# Altium schematic sheet Top Level.SchDoc
size A
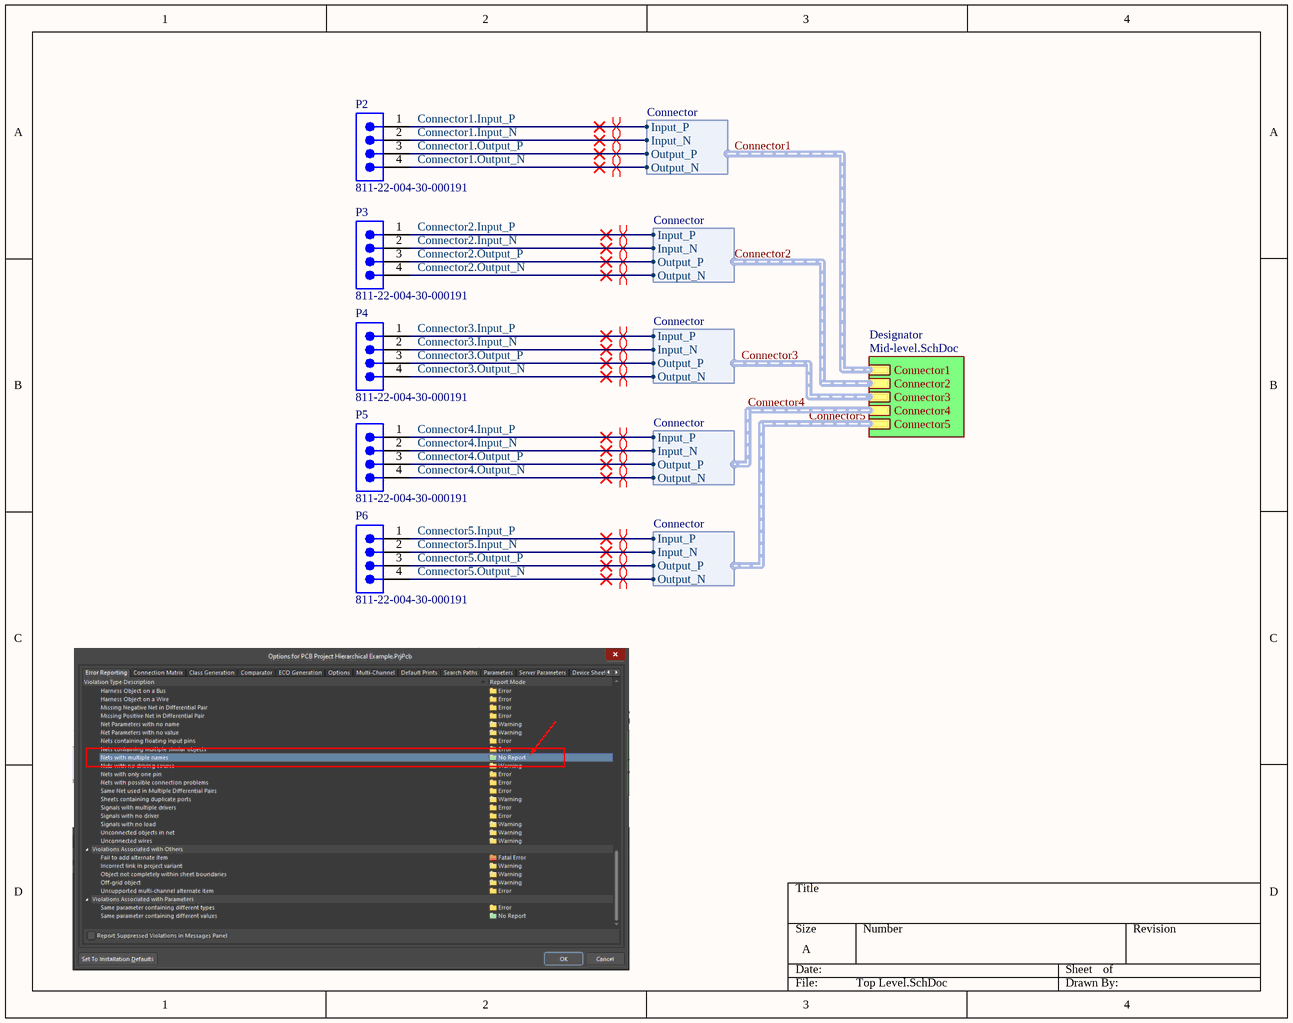
[diagram p0: Top Level.SchDoc]

## Parts
P2  811-22-004-30-000191  [MILL-MAX_811-22-004-30-0001910]
P3  811-22-004-30-000191  [MILL-MAX_811-22-004-30-0001910]
P4  811-22-004-30-000191  [MILL-MAX_811-22-004-30-0001910]
P5  811-22-004-30-000191  [MILL-MAX_811-22-004-30-0001910]
P6  811-22-004-30-000191  [MILL-MAX_811-22-004-30-0001910]

## Sub-sheets
Designator = Mid-level.SchDoc: Connector4 (harness Connector), Connector5 (harness Connector), Connector3 (harness Connector), Connector2 (harness Connector), Connector1 (harness Connector)

## Harnesses
Connector: Input_P, Input_N, Output_P, Output_N

## Nets
Connector1.Input_N: P2.2 ; sheet Designator/Connector1.Input_N
Connector1.Input_P: P2.1 ; sheet Designator/Connector1.Input_P
Connector1.Output_N: P2.4 ; sheet Designator/Connector1.Output_N
Connector1.Output_P: P2.3 ; sheet Designator/Connector1.Output_P
Connector2.Input_N: P3.2 ; sheet Designator/Connector2.Input_N
Connector2.Input_P: P3.1 ; sheet Designator/Connector2.Input_P
Connector2.Output_N: P3.4 ; sheet Designator/Connector2.Output_N
Connector2.Output_P: P3.3 ; sheet Designator/Connector2.Output_P
Connector3.Input_N: P4.2 ; sheet Designator/Connector3.Input_N
Connector3.Input_P: P4.1 ; sheet Designator/Connector3.Input_P
Connector3.Output_N: P4.4 ; sheet Designator/Connector3.Output_N
Connector3.Output_P: P4.3 ; sheet Designator/Connector3.Output_P
Connector4.Input_N: P5.2 ; sheet Designator/Connector4.Input_N
Connector4.Input_P: P5.1 ; sheet Designator/Connector4.Input_P
Connector4.Output_N: P5.4 ; sheet Designator/Connector4.Output_N
Connector4.Output_P: P5.3 ; sheet Designator/Connector4.Output_P
Connector5.Input_N: P6.2 ; sheet Designator/Connector5.Input_N
Connector5.Input_P: P6.1 ; sheet Designator/Connector5.Input_P
Connector5.Output_N: P6.4 ; sheet Designator/Connector5.Output_N
Connector5.Output_P: P6.3 ; sheet Designator/Connector5.Output_P

## Buses and harness runs
harness Connector1 = sheet Designator/Connector1
harness Connector2 = sheet Designator/Connector2
harness Connector3 = sheet Designator/Connector3
harness Connector4 = sheet Designator/Connector4
harness Connector5 = sheet Designator/Connector5

## Layout directives
differential pair: Connector1.Input_N, Connector1.Input_P, Connector1.Output_N, Connector1.Output_P, Connector2.Input_N, Connector2.Input_P, Connector2.Output_N, Connector2.Output_P, Connector3.Input_N, Connector3.Input_P, Connector3.Output_N, Connector3.Output_P, Connector4.Input_N, Connector4.Input_P, Connector4.Output_N, Connector4.Output_P, Connector5.Input_N, Connector5.Input_P, Connector5.Output_N, Connector5.Output_P

## Library data of the parts
P2-P6 = CMP-1650-00001-1: Spring-Loaded Connector, 2.54 Grid Surface Mount, Low Profile Single Row Strip, Vertical, 4-Pin Header, RoHS, Tape and Reel; No. of Positions: 4; Current Rating: 2000 mA; Gender: Male; Pitch: 2.54 mm; No. of Rows: 1; ComponentLink3Description: Package Specification; ComponentLink1Description: Manufacturer URL; Part Number: 811-22-004-30-000191; PartNumber: 811-22-004-30-000191; ComponentLink2URL: http://www.mill-max.com/products/datasheet/sockets/811-22-004-30-000191; ComponentLink2Description: Datasheet; PackageDescription: 4-Pin Header, Body 10.16 x 2.54 mm, Pitch 2.54 mm; Packing: Tape and Reel; ComponentLink1URL: http://www.mill-max.com/; RoHS: TRUE; Orientation: Vertical; ComponentLink3URL: http://www.mill-max.com/assets/pdfs/metric/007M.PDF; Mounting Technology: Surface Mount